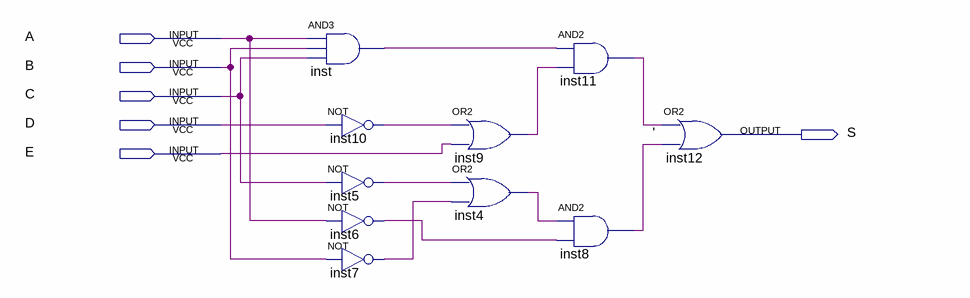
[diagram p0: schematic sheet]
// Quartus schematic circ_2.bdf as structural Verilog: 10 symbols, 6 pins
module circ_2 (
  input  A,
  input  B,
  input  C,
  input  D,
  input  E,
  output S
);

  wire \' , inst4_out, inst5_out, inst6_out, inst7_out, inst9_out, inst10_out, inst11_out, inst_out;

  and inst (inst_out, A, B, C);
  not inst10 (inst10_out, D);
  not inst5 (inst5_out, C);
  not inst6 (inst6_out, A);
  not inst7 (inst7_out, B);
  or inst9 (inst9_out, inst10_out, E);
  or inst4 (inst4_out, inst5_out, inst7_out);
  and inst11 (inst11_out, inst_out, inst9_out);
  and inst8 (\' , inst4_out, inst6_out);
  or inst12 (S, inst11_out, \' );
endmodule
